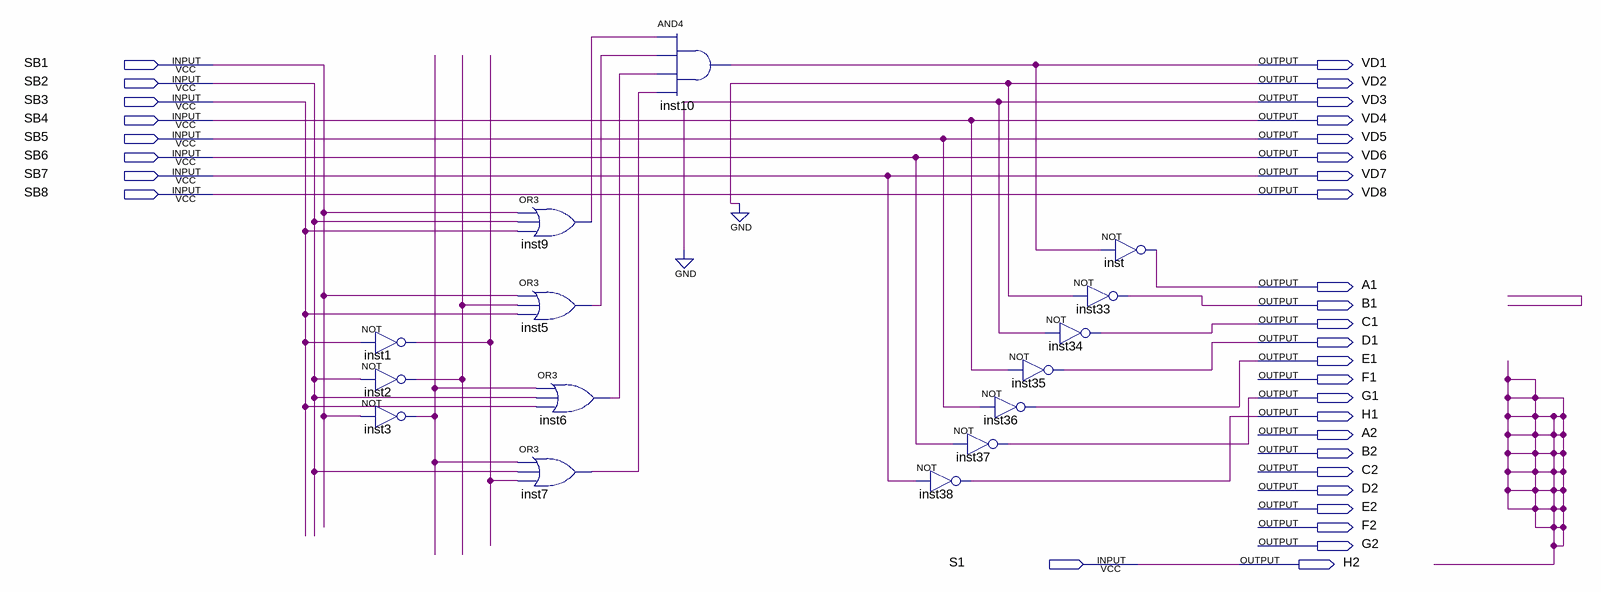
[diagram p0: schematic sheet]
// Quartus schematic 20февраля.bdf as structural Verilog: 15 symbols, 33 pins
module \20февраля  (
  input  SB1,
  input  SB2,
  input  SB3,
  input  SB4,
  input  SB5,
  input  SB6,
  input  SB7,
  input  SB8,
  input  S1,
  output VD1,
  output VD2,
  output VD3,
  output VD4,
  output VD5,
  output VD6,
  output VD7,
  output VD8,
  output A1,
  output B1,
  output C1,
  output D1,
  output E1,
  output F1,
  output G1,
  output H1,
  output A2,
  output B2,
  output C2,
  output D2,
  output E2,
  output F2,
  output G2,
  output H2
);

  wire inst1_out, inst2_out, inst3_out, inst5_out, inst6_out, inst7_out, inst9_out;

  not inst1 (inst1_out, SB3);
  not inst2 (inst2_out, SB2);
  not inst3 (inst3_out, SB1);
  or inst9 (inst9_out, SB1, SB2, SB3);
  or inst5 (inst5_out, SB1, inst2_out, SB3);
  or inst6 (inst6_out, inst3_out, SB2, SB3);
  or inst7 (inst7_out, inst3_out, SB2, inst1_out);
  and inst10 (VD1, inst9_out, inst5_out, inst6_out, inst7_out);
  not inst38 (H1, SB7);
  not inst36 (E1, SB5);
  not inst37 (G1, SB6);
  not inst34 (C1, 1'b0);
  not inst35 (D1, SB4);
  not inst (A1, VD1);
  not inst33 (B1, 1'b0);

  assign H2 = S1;
  assign VD2 = 1'b0;
  assign VD3 = 1'b0;
  assign VD4 = SB4;
  assign VD5 = SB5;
  assign VD6 = SB6;
  assign VD7 = SB7;
  assign VD8 = SB8;
endmodule
